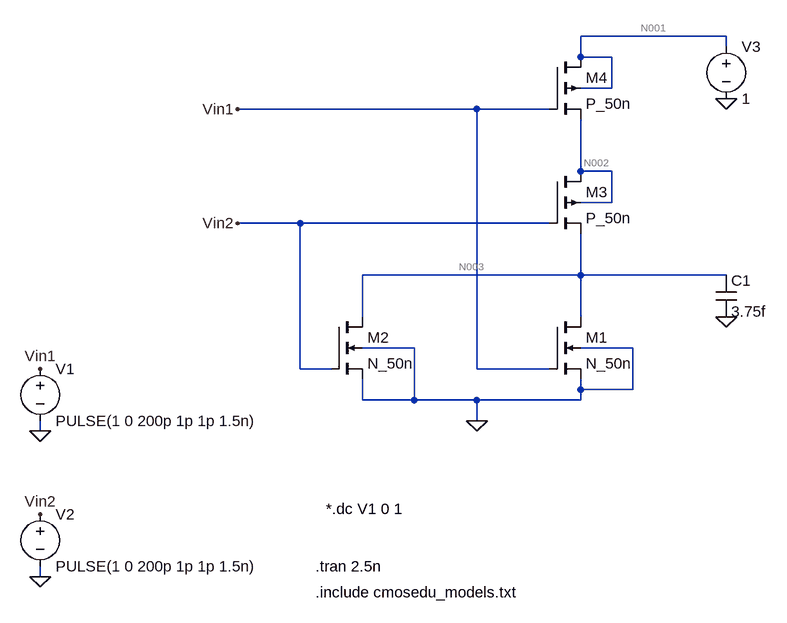
[diagram p0: schematic NOR.asc]
NOR.asc, the LTspice schematic file:
Version 4
SHEET 1 3248 1176
WIRE 336 -304 112 -304
WIRE 336 -288 336 -304
WIRE 112 -272 112 -304
WIRE 160 -272 112 -272
WIRE 160 -224 160 -272
WIRE 160 -224 112 -224
WIRE -48 -192 -416 -192
WIRE 64 -192 -48 -192
WIRE 112 -96 112 -176
WIRE 160 -96 112 -96
WIRE 160 -48 160 -96
WIRE 160 -48 112 -48
WIRE -320 -16 -416 -16
WIRE 64 -16 -320 -16
WIRE 112 64 112 0
WIRE 112 64 -224 64
WIRE 336 64 112 64
WIRE -224 128 -224 64
WIRE 112 128 112 64
WIRE -144 176 -224 176
WIRE 192 176 112 176
WIRE -320 208 -320 -16
WIRE -272 208 -320 208
WIRE -48 208 -48 -192
WIRE 64 208 -48 208
WIRE 112 240 112 224
WIRE 192 240 192 176
WIRE 192 240 112 240
WIRE -224 256 -224 224
WIRE -144 256 -144 176
WIRE -144 256 -224 256
WIRE -48 256 -144 256
WIRE 112 256 112 240
WIRE 112 256 -48 256
WIRE -48 288 -48 256
WIRE -720 304 -720 288
WIRE -720 528 -720 512
FLAG -48 288 0
FLAG 336 -208 0
FLAG 336 128 0
FLAG -720 528 0
FLAG -720 304 0
FLAG -720 208 Vin1
FLAG -416 -192 Vin1
FLAG -720 432 Vin2
FLAG -416 -16 Vin2
SYMBOL nmos4 64 128 R0
SYMATTR InstName M1
SYMATTR Value N_50n
SYMATTR Value2 l=50n w=500n
SYMBOL nmos4 -272 128 R0
SYMATTR InstName M2
SYMATTR Value N_50n
SYMATTR Value2 l=50n w=500n
SYMBOL pmos4 64 -96 R0
SYMATTR InstName M3
SYMATTR Value P_50n
SYMATTR Value2 l=50n w=2000n
SYMBOL pmos4 64 -272 R0
SYMATTR InstName M4
SYMATTR Value P_50n
SYMATTR Value2 l=50n w=2000n
SYMBOL voltage 336 -304 R0
WINDOW 123 0 0 Left 0
WINDOW 39 0 0 Left 0
SYMATTR InstName V3
SYMATTR Value 1
SYMBOL cap 320 64 R0
SYMATTR InstName C1
SYMATTR Value 3.75f
SYMBOL voltage -720 416 R0
WINDOW 123 0 0 Left 0
WINDOW 39 0 0 Left 0
SYMATTR InstName V2
SYMATTR Value PULSE(1 0 200p 1p 1p 1.5n)
SYMBOL voltage -720 192 R0
WINDOW 123 0 0 Left 0
WINDOW 39 0 0 Left 0
SYMATTR InstName V1
SYMATTR Value PULSE(1 0 200p 1p 1p 1.5n)
TEXT -296 512 Left 2 !.tran 2.5n
TEXT -280 424 Left 2 !*.dc V1 0 1
TEXT -296 552 Left 2 !.include cmosedu_models.txt

The netlist it stands for:
* NOR.asc
M1 N003 Vin1 0 0 N_50n l=50n w=500n
M2 N003 Vin2 0 0 N_50n l=50n w=500n
M3 N002 Vin2 N003 N002 P_50n l=50n w=2000n
M4 N001 Vin1 N002 N001 P_50n l=50n w=2000n
V3 N001 0 1
C1 N003 0 3.75f
V2 Vin2 0 PULSE(1 0 200p 1p 1p 1.5n)
V1 Vin1 0 PULSE(1 0 200p 1p 1p 1.5n)
.model NMOS NMOS
.model PMOS PMOS
.lib standard.mos
.tran 2.5n
*.dc V1 0 1
.include cmosedu_models.txt
.backanno
.end

* Results of the author's LTspice run, read from the files saved beside the schematic
* Operating Point, zero values left out:
*   V(n003) = 13.93 µV
*   V(vin1) = 1 V
*   V(vin2) = 1 V
*   V(n002) = 940.4 mV
*   V(n001) = 1 V
*   Id(M4) = 2.461 nA
*   Ig(M4) = 20.87 pA
*   Is(M4) = -2.481 nA
*   Id(M3) = 2.481 nA
*   Ig(M3) = 22.42 nA
*   Is(M3) = -24.9 nA
*   Id(M2) = 12.45 nA
*   Ig(M2) = 1.747 nA
*   Ib(M2) = -32.94 pA
*   Is(M2) = -14.16 nA
*   Id(M1) = 12.45 nA
*   Ig(M1) = 1.747 nA
*   Ib(M1) = -32.94 pA
*   Is(M1) = -14.16 nA
*   I(V1) = -1.768 nA
*   I(V2) = -24.16 nA
*   I(V3) = -2.461 nA
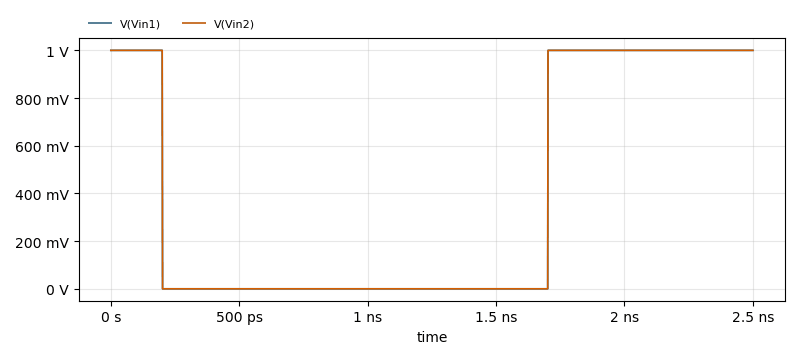
[diagram p1: Transient Analysis of NOR.asc, plotted from the saved traces]
* Transient Analysis, 1 run:
*   V(Vin1): min 0 V, max 1 V, average 399.6 mV, rms 632 mV, last 1 V
*   V(Vin2): min 0 V, max 1 V, average 399.6 mV, rms 632 mV, last 1 V